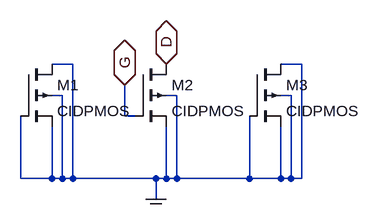
[diagram p0: schematic Unidad_P.asc]
Unidad_P.asc, the LTspice schematic file:
Version 4.1
SHEET 1 880 680
WIRE 96 128 64 128
WIRE 448 128 416 128
WIRE 80 176 64 176
WIRE 256 176 240 176
WIRE 432 176 416 176
WIRE 176 208 176 160
WIRE 192 208 176 208
WIRE 16 304 16 208
WIRE 64 304 64 224
WIRE 64 304 16 304
WIRE 80 304 80 176
WIRE 80 304 64 304
WIRE 96 304 96 128
WIRE 96 304 80 304
WIRE 224 304 96 304
WIRE 240 304 240 224
WIRE 240 304 224 304
WIRE 256 304 256 176
WIRE 256 304 240 304
WIRE 368 304 368 208
WIRE 368 304 256 304
WIRE 416 304 416 224
WIRE 416 304 368 304
WIRE 432 304 432 176
WIRE 432 304 416 304
WIRE 448 304 448 128
WIRE 448 304 432 304
WIRE 224 336 224 304
FLAG 240 128 D
IOPIN 240 128 BiDir
FLAG 176 160 G
IOPIN 176 160 BiDir
FLAG 224 336 COM
IOPIN 224 336 BiDir
SYMBOL pmos4 16 128 R0
SYMATTR InstName M1
SYMATTR Value CIDPMOS
SYMATTR Value2 l=10u w=100u
SYMBOL pmos4 192 128 R0
SYMATTR InstName M2
SYMATTR Value CIDPMOS
SYMATTR Value2 l=10u w=100u
SYMBOL pmos4 368 128 R0
SYMATTR InstName M3
SYMATTR Value CIDPMOS
SYMATTR Value2 l=10u w=100u

The netlist it stands for:
* Unidad_P.asc
M1 COM COM COM COM CIDPMOS l=10u w=100u
M2 D G COM COM CIDPMOS l=10u w=100u
M3 COM COM COM COM CIDPMOS l=10u w=100u
.model NMOS NMOS
.model PMOS PMOS
.lib standard.mos
.backanno
.end